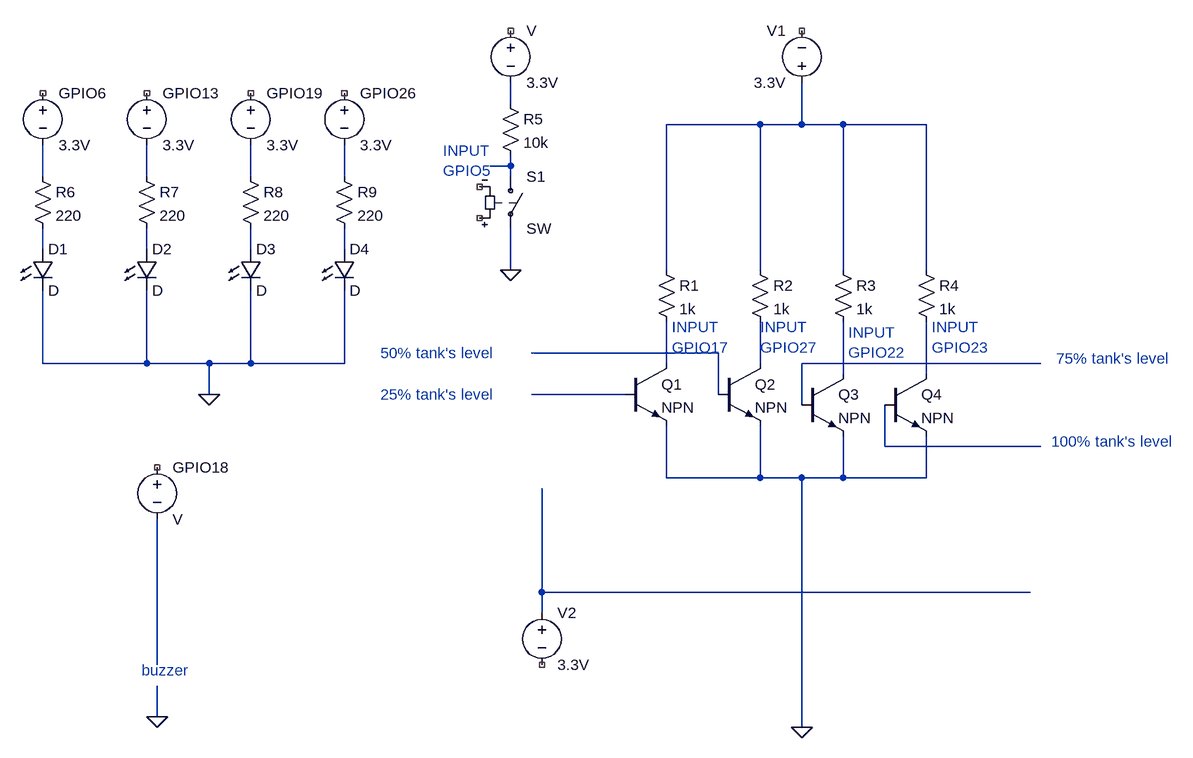
[diagram p0: schematic Measurement_waterLevel.asc]
Measurement_waterLevel.asc, the LTspice schematic file:
Version 4
SHEET 1 900 804
WIRE -144 -176 -144 -208
WIRE 240 -144 96 -144
WIRE 304 -144 304 -208
WIRE 304 -144 240 -144
WIRE 368 -144 304 -144
WIRE 496 -144 368 -144
WIRE -144 -80 -144 -96
WIRE -144 -80 -176 -80
WIRE -864 -64 -864 -112
WIRE -704 -64 -704 -112
WIRE -544 -64 -544 -112
WIRE -400 -64 -400 -112
WIRE -144 -64 -144 -80
WIRE -864 48 -864 16
WIRE -704 48 -704 16
WIRE -544 48 -544 16
WIRE -400 48 -400 16
WIRE -144 80 -144 16
WIRE 96 80 96 -144
WIRE 240 80 240 -144
WIRE 368 80 368 -144
WIRE 496 80 496 -144
WIRE 176 208 -112 208
WIRE -864 224 -864 112
WIRE -704 224 -704 112
WIRE -704 224 -864 224
WIRE -608 224 -704 224
WIRE -544 224 -544 112
WIRE -544 224 -608 224
WIRE -400 224 -400 112
WIRE -400 224 -544 224
WIRE 96 224 96 160
WIRE 240 224 240 160
WIRE 672 224 304 224
WIRE 368 240 368 160
WIRE 496 240 496 160
WIRE -608 272 -608 224
WIRE 32 272 -112 272
WIRE 176 272 176 208
WIRE 304 288 304 224
WIRE 432 352 432 288
WIRE 672 352 432 352
WIRE 96 400 96 320
WIRE 240 400 240 320
WIRE 240 400 96 400
WIRE 304 400 240 400
WIRE 368 400 368 336
WIRE 368 400 304 400
WIRE 496 400 496 336
WIRE 496 400 368 400
WIRE -96 576 -96 416
WIRE 656 576 -96 576
WIRE -96 608 -96 576
WIRE -688 688 -688 464
WIRE -688 768 -688 720
WIRE 304 784 304 400
FLAG 304 784 0
FLAG -608 272 0
FLAG -144 80 0
FLAG -688 768 0
SYMBOL res 80 64 R0
SYMATTR InstName R1
SYMATTR Value 1k
SYMBOL res 224 64 R0
SYMATTR InstName R2
SYMATTR Value 1k
SYMBOL res 352 64 R0
SYMATTR InstName R3
SYMATTR Value 1k
SYMBOL res 480 64 R0
SYMATTR InstName R4
SYMATTR Value 1k
SYMBOL npn 32 224 R0
SYMATTR InstName Q1
SYMBOL npn 176 224 R0
SYMATTR InstName Q2
SYMBOL npn 304 240 R0
SYMATTR InstName Q3
SYMBOL npn 432 240 R0
SYMATTR InstName Q4
SYMBOL LED -880 48 R0
SYMATTR InstName D1
SYMBOL LED -720 48 R0
SYMATTR InstName D2
SYMBOL LED -560 48 R0
SYMATTR InstName D3
SYMBOL LED -416 48 R0
SYMATTR InstName D4
SYMBOL voltage 304 -192 R180
WINDOW 0 24 96 Left 2
WINDOW 3 24 16 Left 2
SYMATTR InstName V1
SYMATTR Value 3.3V
SYMBOL voltage -96 592 R0
SYMATTR InstName V2
SYMATTR Value 3.3V
SYMBOL voltage -864 -208 R0
SYMATTR InstName GPIO6
SYMATTR Value 3.3V
SYMBOL voltage -704 -208 R0
SYMATTR InstName GPIO13
SYMATTR Value 3.3V
SYMBOL voltage -544 -208 R0
SYMATTR InstName GPIO19
SYMATTR Value 3.3V
SYMBOL voltage -400 -208 R0
SYMATTR InstName GPIO26
SYMATTR Value 3.3V
SYMBOL res -880 -80 R0
SYMATTR InstName R6
SYMATTR Value 220
SYMBOL res -720 -80 R0
SYMATTR InstName R7
SYMATTR Value 220
SYMBOL res -560 -80 R0
SYMATTR InstName R8
SYMATTR Value 220
SYMBOL res -416 -80 R0
SYMATTR InstName R9
SYMATTR Value 220
SYMBOL voltage -144 -304 R0
SYMATTR InstName V
SYMATTR Value 3.3V
SYMBOL sw -144 -80 R0
SYMATTR InstName S1
SYMBOL res -160 -192 R0
SYMATTR InstName R5
SYMATTR Value 10k
SYMBOL voltage -688 368 R0
SYMATTR InstName GPIO18
TEXT -344 272 Left 2 ;25% tank's level
TEXT -344 208 Left 2 ;50% tank's level
TEXT 696 216 Left 2 ;75% tank's level
TEXT 688 344 Left 2 ;100% tank's level
TEXT 104 168 Left 2 ;INPUT\nGPIO17
TEXT 240 168 Left 2 ;INPUT\nGPIO27
TEXT 376 176 Left 2 ;INPUT\nGPIO22
TEXT 504 168 Left 2 ;INPUT\nGPIO23
TEXT -712 696 Left 2 ;buzzer
TEXT -248 -104 Left 2 ;INPUT\nGPIO5

The netlist it stands for:
* Measurement_waterLevel.asc
R1 N002 N013 1k
R2 N002 N014 1k
R3 N002 N016 1k
R4 N002 N017 1k
Q1 N013 N018 0 0 NPN
Q2 N014 N012 0 0 NPN
Q3 N016 N015 0 0 NPN
Q4 N017 N019 0 0 NPN
D1 N008 0 D
D2 N009 0 D
D3 N010 0 D
D4 N011 0 D
V1 N002 NC_01 3.3V
V2 N020 NC_02 3.3V
V§GPIO6 NC_03 N004 3.3V
V§GPIO13 NC_04 N005 3.3V
V§GPIO19 NC_05 N006 3.3V
V§GPIO26 NC_06 N007 3.3V
R6 N004 N008 220
R7 N005 N009 220
R8 N006 N010 220
R9 N007 N011 220
V NC_07 N001 3.3V
S1 N003 0 NC_08 NC_09 SW
R5 N001 N003 10k
V§GPIO18 NC_10 N021 V
.model D D
.lib standard.dio
.model NPN NPN
.model PNP PNP
.lib standard.bjt
* 25% tank's level
* 50% tank's level
* 75% tank's level
* 100% tank's level
* INPUT
* GPIO17
* INPUT
* GPIO27
* INPUT
* GPIO22
* INPUT
* GPIO23
* buzzer
* INPUT
* GPIO5
.backanno
.end